# Altium schematic sheet power.SchDoc
size Letter
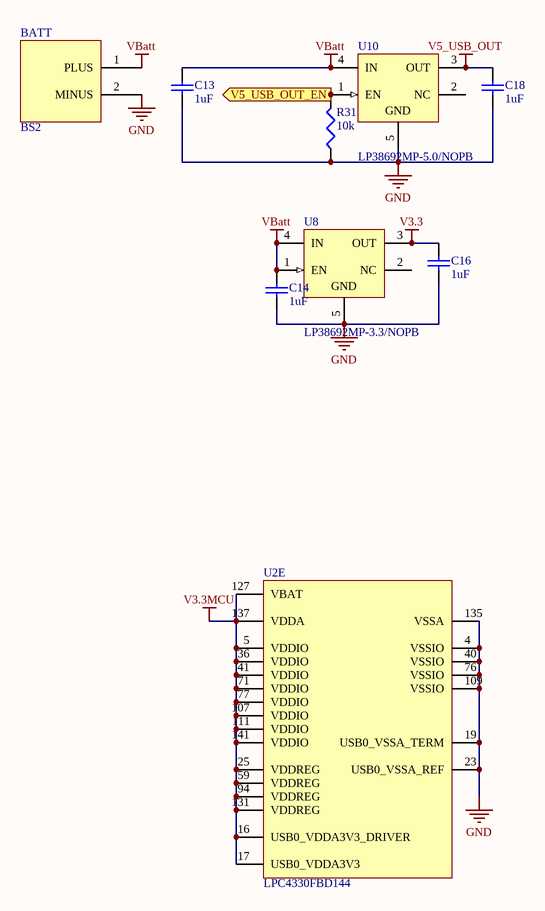
[diagram p0: power.SchDoc]

## Parts
BATT  BS2  [PCBComponent_1]
C13  1uF  [1608[0603]]
C14  1uF  [1608[0603]]
C16  1uF  [1608[0603]]
C18  1uF  [1608[0603]]
R31  10k  [J1-0603]
U2  LPC4330FBD144  [SOT486-1_V]  (part E of 5)
U8  LP38692MP-3.3/NOPB  [MP05A_N]
U10  LP38692MP-5.0/NOPB  [MP05A_N]

## Ports
V5_USB_OUT_EN (in)

## Nets
GND: BATT.2(MINUS) C13.1 C14.1 C16.1 C18.1 R31.1 U2.4(VSSIO) U2.19(USB0_VSSA_TERM) U2.23(USB0_VSSA_REF) U2.40(VSSIO) U2.76(VSSIO) U2.109(VSSIO) U2.135(VSSA) U8.5(GND) U10.5(GND)
V3.3: C16.2 U8.3(OUT)
V3.3MCU: U2.5(VDDIO) U2.16(USB0_VDDA3V3_DRIVER) U2.17(USB0_VDDA3V3) U2.25(VDDREG) U2.36(VDDIO) U2.41(VDDIO) U2.59(VDDREG) U2.71(VDDIO) U2.77(VDDIO) U2.94(VDDREG) U2.107(VDDIO) U2.111(VDDIO) U2.127(VBAT) U2.131(VDDREG) U2.137(VDDA) U2.141(VDDIO)
V5_USB_OUT: C18.2 U10.3(OUT)
VBatt: BATT.1(PLUS) C13.2 C14.2 U8.1(EN) U8.4(IN) U10.4(IN)
V5_USB_OUT_EN: R31.2 U10.1(EN) ; port V5_USB_OUT_EN

Not connected (* = marked no-connect by the designer): U8 2(NC); U10 2(NC)

## Library data of the parts
C13 C14 C16 C18 = Cap Semi: Capacitor (Semiconductor SIM Model); Value: 100pF; Published: 8-Jun-2000; LatestRevisionDate: 29-May-2009; LatestRevisionNote: IPC-7351 Footprint Added.; PackageReference: C1206; Publisher: Altium Limited; PackageDescription: Chip Capacitor
R31 = Res3: Resistor; Value: 1K; Published: 8-Jun-2000; LatestRevisionDate: 29-May-2009; LatestRevisionNote: IPC-7351 Footprint Added.; PackageReference: J1-0603; Publisher: Altium Limited; PackageDescription: Chip Resistor
U2 = LPC4330FBD144: 32-bit ARM Cortex-M4 MCU, 264 kB SRAM, 2 HS USB with on-chip PHY, Ethernet, CAN, AES, SPIFI, SGPIO, SCT, 144-Pin LQFP; fmax: 204 MHz; GPIOs: 83; SRAM: 264 kB; ROM: 64 kB; Ethernet: Y; USB: 2; ADC channels: 8; SPI: 1; UART: 4; VDD (min): 2.2 V; VDD (max): 3.6 V; Code_IEC: 136E23; DatasheetVersion: Rev.3.1, Jan-2012; PackageVersion: Feb-2003; PackageReference: SOT486-1; PackageDescription: LQFP144: Plastic Low Profile Quad Flat Package; 144 Leads; Body 20 x 20 x 1.4 mm; PWM: Y; PLL: Y; I2C: 2; CAN: 2; Timers: 4; Code_JEDEC: MS-026; ComponentLink1Description: Manufacturer URL; ComponentLink1URL: http://www.nxp.com/; ComponentLink2Description: Datasheet; ComponentLink2URL: http://www.nxp.com/documents/data_sheet/LPC4350_30_20_10.pdf
U8 = LP38692MP-3.3/NOPB: 1A Low Dropout CMOS Linear Regulators, Stable with Ceramic Output Capacitors, 5-pin SOT-223, Pb-Free; Manufacturer: National Semiconductor; PackageTopMarking: XYTT*LJSB; PowerWise: Y; CompType: LDO IC; DatasheetVersion: May-2005; PackageVersion: revA, Jan-2000; PackageReference: MP05A; PackageDescription: Moldec SOT-223, 6.50 x 3.56 x 1.6mm Body, 5 Lead, 1.5mm Pitch; PartNumber: LP38692MP-3.3/NOPB; RoHS: Y; PinCount: 5; High-Reliability: Y; Code_JEDEC: TO-261-AB; Code_IPC: SOT223-5; ComponentLink1Description: Manufacturer URL; ComponentLink1URL: http://www.national.com/; ComponentLink2Description: LP38692 Datasheet; ComponentLink2URL: http://www.national.com/ds/LP/LP38692.pdf; ComponentLink3Description: LP38692 Web Page; ComponentLink3URL: http://www.national.com/pf/LP/LP38692.html; ComponentLink4Description: MP05A Package Page; ComponentLink4URL: http://www.national.com/packaging/folders/mp05a.html
U10 = LP38692MP-5.0/NOPB: 1A Low Dropout CMOS Linear Regulators, Stable with Ceramic Output Capacitors, 5-pin SOT-223, Pb-Free; Manufacturer: National Semiconductor; PackageTopMarking: XYTT*LJTB; PowerWise: Y; CompType: LDO IC; DatasheetVersion: May-2005; PackageVersion: revA, Jan-2000; PackageReference: MP05A; PackageDescription: Moldec SOT-223, 6.50 x 3.56 x 1.6mm Body, 5 Lead, 1.5mm Pitch; PartNumber: LP38692MP-5.0/NOPB; RoHS: Y; PinCount: 5; High-Reliability: Y; Code_JEDEC: TO-261-AB; Code_IPC: SOT223-5; ComponentLink1Description: Manufacturer URL; ComponentLink1URL: http://www.national.com/; ComponentLink2Description: LP38692 Datasheet; ComponentLink2URL: http://www.national.com/ds/LP/LP38692.pdf; ComponentLink3Description: LP38692 Web Page; ComponentLink3URL: http://www.national.com/pf/LP/LP38692.html; ComponentLink4Description: MP05A Package Page; ComponentLink4URL: http://www.national.com/packaging/folders/mp05a.html